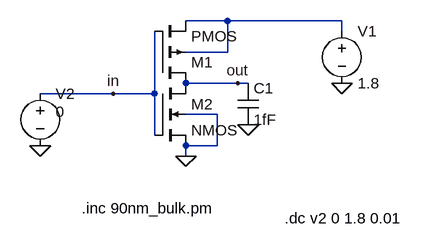
[diagram p0: schematic conventional.asc]
conventional.asc, the LTspice schematic file:
Version 4
SHEET 1 960 4320
WIRE 240 96 176 96
WIRE 416 96 240 96
WIRE 416 112 416 96
WIRE 240 144 240 96
WIRE 240 144 176 144
WIRE 256 192 176 192
WIRE 272 192 256 192
WIRE 64 208 -48 208
WIRE 128 208 128 112
WIRE 128 208 64 208
WIRE 224 240 176 240
WIRE 128 272 128 208
WIRE 224 288 224 240
WIRE 224 288 176 288
WIRE 176 304 176 288
FLAG 416 192 0
FLAG -48 288 0
FLAG 256 192 out
FLAG 64 208 in
FLAG 176 304 0
FLAG 272 256 0
SYMBOL voltage 416 96 R0
WINDOW 123 0 0 Left 0
WINDOW 39 0 0 Left 0
SYMATTR InstName V1
SYMATTR Value 1.8
SYMBOL voltage -48 192 R0
WINDOW 123 0 0 Left 0
WINDOW 39 0 0 Left 0
WINDOW 3 24 44 Left 2
SYMATTR Value 0
SYMATTR InstName V2
SYMBOL pmos4 128 192 M180
SYMATTR InstName M1
SYMATTR Value2 l=100n w=330n
SYMBOL nmos4 128 192 R0
SYMATTR InstName M2
SYMATTR Value2 l=100n w=120n
SYMBOL cap 256 192 R0
SYMATTR InstName C1
SYMATTR Value 1fF
TEXT 328 400 Left 2 !.dc v2 0 1.8 0.01
TEXT 16 384 Left 2 !.inc 90nm_bulk.pm

The netlist it stands for:
* conventional.asc
V1 N001 0 1.8
V2 in 0 0
M1 out in N001 N001 PMOS l=100n w=330n
M2 out in 0 0 NMOS l=100n w=120n
C1 out 0 1fF
.model NMOS NMOS
.model PMOS PMOS
.lib standard.mos
.dc v2 0 1.8 0.01
.inc 90nm_bulk.pm
.backanno
.end